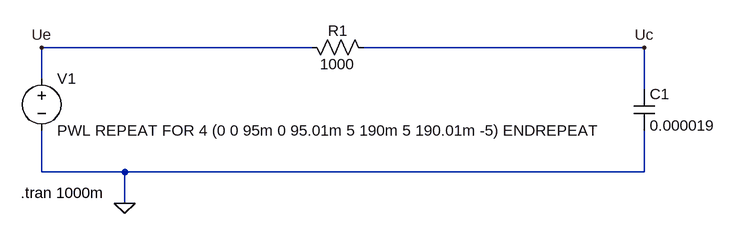
[diagram p0: schematic Maximilian_Wein.asc]
Maximilian_Wein.asc, the LTspice schematic file:
Version 4
SHEET 1 1236 680
WIRE 384 128 -32 128
WIRE 896 128 464 128
WIRE -32 176 -32 128
WIRE 896 192 896 128
WIRE -32 320 -32 256
WIRE 96 320 -32 320
WIRE 896 320 896 256
WIRE 896 320 96 320
WIRE 96 368 96 320
FLAG 96 368 0
FLAG -32 128 Ue
FLAG 896 128 Uc
SYMBOL res 480 144 M270
WINDOW 0 26 56 VTop 2
WINDOW 3 6 56 VBottom 2
SYMATTR InstName R1
SYMATTR Value 1000
SYMATTR SpiceLine tol=1 pwr=0.1
SYMBOL voltage -32 160 R0
SYMATTR InstName V1
SYMATTR Value PWL REPEAT FOR 4 (0 0 95m 0 95.01m 5 190m 5 190.01m -5) ENDREPEAT
SYMBOL cap 880 192 R0
SYMATTR InstName C1
SYMATTR Value 0.000019
TEXT -64 352 Left 2 !.tran 1000m

The netlist it stands for:
* Maximilian_Wein.asc
R1 Uc Ue 1000 tol=1 pwr=0.1
V1 Ue 0 PWL REPEAT FOR 4 (0 0 95m 0 95.01m 5 190m 5 190.01m -5) ENDREPEAT
C1 Uc 0 0.000019
.tran 1000m
.backanno
.end

* Results of the author's LTspice run, read from the files saved beside the schematic
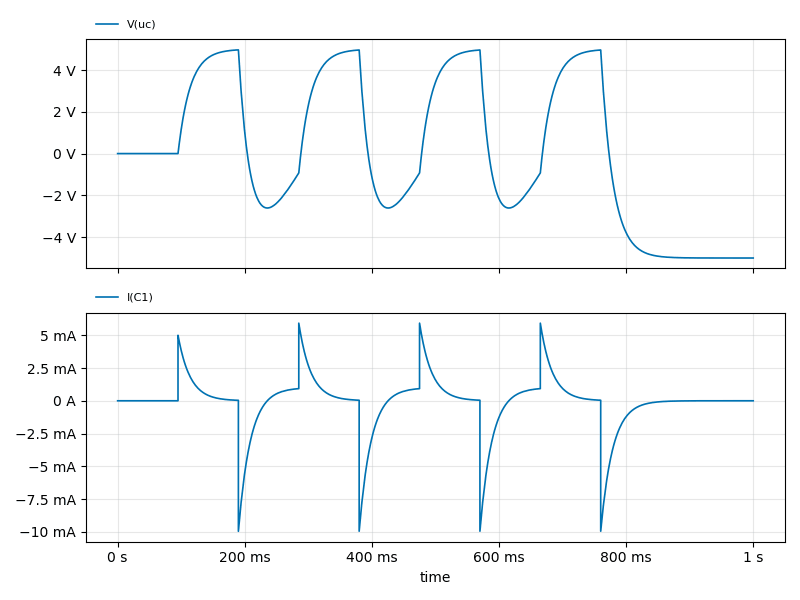
[diagram p1: Transient Analysis of Maximilian_Wein.asc, plotted from the saved traces]
* Transient Analysis, 1 run:
*   V(uc): min -5 V, max 4.966 V, average 84.16 mV, rms 3.574 V, last -5 V
*   I(C1): min -9.964 mA, max 5.924 mA, average -96.56 µA, rms 2.168 mA, last -32.51 nA